# EAGLE design BPtoJTAG_ICSP - Rev A1 (EAGLE 7.7.0)
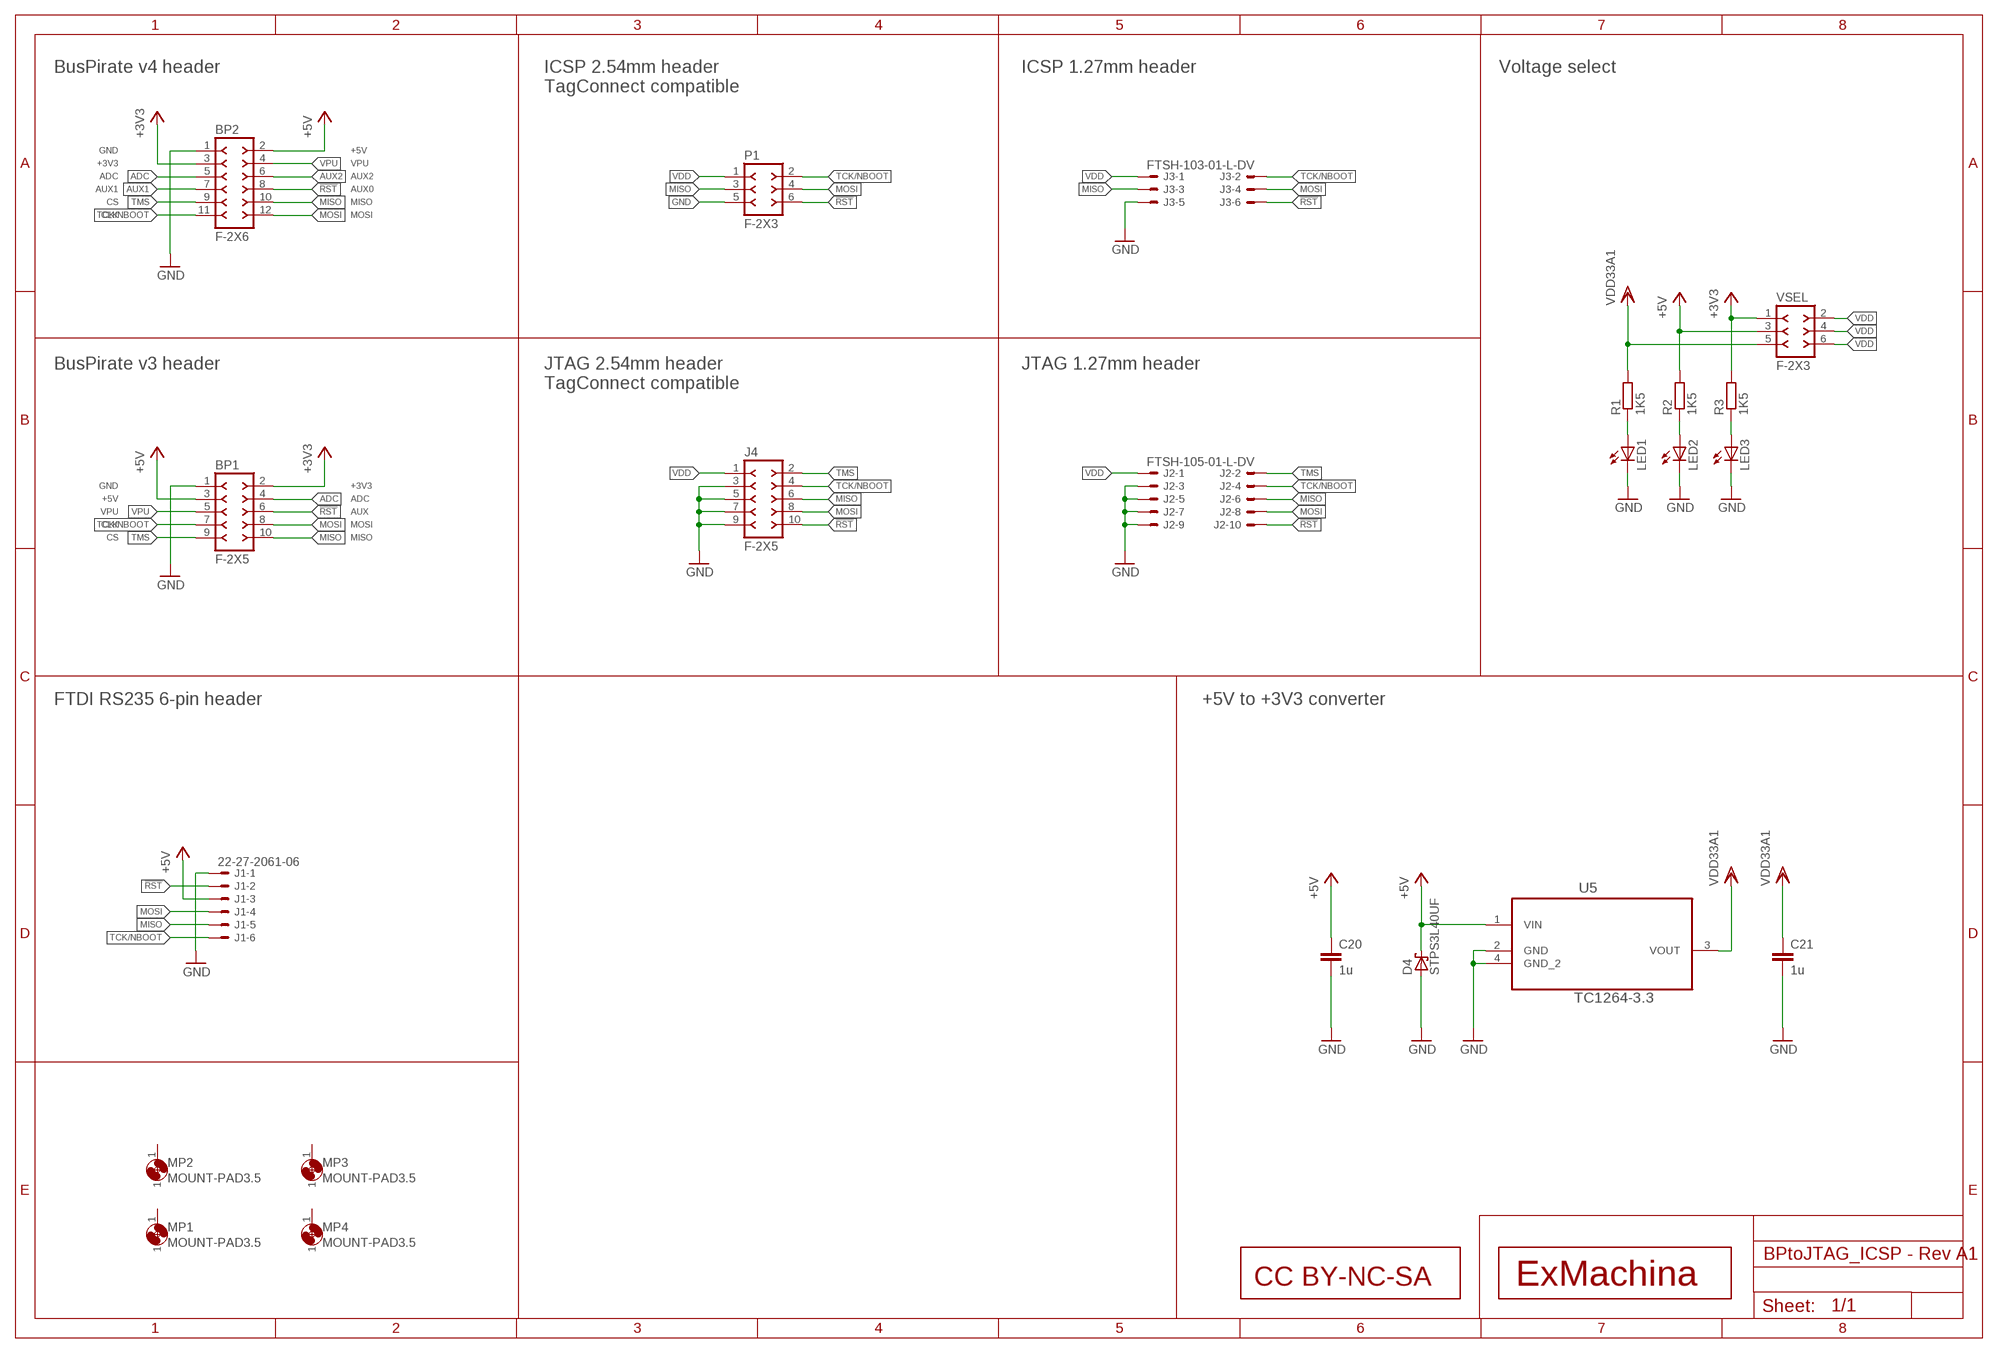
[diagram p0: schematic, sheet 1]

## Parts
BP1  F-2X5  [DIL-100-2X5]
BP2  F-2X6  [DIL-100-2X6]
C20  1u  C-EUC0603  [C0603]
C21  1u  C-EUC0603  [C0603]
CC1  CC-BY-NC-SA  [CC-BY-NC-SA]
D4  STPS3L40UF  [SMB]
J1  22-27-2061-06  [6410-06]
J2  FTSH-105-01-L-DV  [FTSH-105-01-L-DV]
J3  FTSH-103-01-L-DV  [FTSH-103-01-L-DV]
J4  F-2X5  [DIL-100-2X5]
LED1  LEDCHIPLED_0603  [CHIPLED_0603]
LED2  LEDCHIPLED_0603  [CHIPLED_0603]
LED3  LEDCHIPLED_0603  [CHIPLED_0603]
MP1  MOUNT-PAD3.5  [P3,5]
MP2  MOUNT-PAD3.5  [P3,5]
MP3  MOUNT-PAD3.5  [P3,5]
MP4  MOUNT-PAD3.5  [P3,5]
P1  F-2X3  [DIL-100-2X3]
R1  1K5  R-EU_R0603  [R0603]
R2  1K5  R-EU_R0603  [R0603]
R3  1K5  R-EU_R0603  [R0603]
T1  EXMACHINA-LOGO-NAME  [EXM-LOGO-BASELINE]
U5  TC1264-3.3  [SOT230P700X180-4N]
VSEL  F-2X3  [DIL-100-2X3]

## Nets
!RST: BP1.6 BP2.8 J1.2 J2.10 J3.6 J4.10 P1.6
+3V3 [supply]: BP1.2 BP2.3 R3.2 VSEL.1
+5V [supply]: BP1.3 BP2.2 C20.1 D4.C J1.3 R2.2 U5.1(VIN) VSEL.3
ADC: BP1.4 BP2.5
AUX1: BP2.7
AUX2: BP2.6
GND [supply]: BP1.1 BP2.1 C20.2 C21.2 D4.A J1.1 J2.3 J2.5 J2.7 J2.9 J3.5 J4.3 J4.5 J4.7 J4.9 LED1.C LED2.C LED3.C P1.5 U5.2(GND) U5.4(GND_2)
MISO: BP1.10 BP2.10 J1.5 J2.6 J3.3 J4.6 P1.3
MOSI: BP1.8 BP2.12 J1.4 J2.8 J3.4 J4.8 P1.4
N$1: LED1.A R1.1
N$2: LED2.A R2.1
N$3: LED3.A R3.1
TCK/NBOOT: BP1.7 BP2.11 J1.6 J2.4 J3.2 J4.4 P1.2
TMS: BP1.9 BP2.9 J2.2 J4.2
VDD [supply]: J2.1 J3.1 J4.1 P1.1 VSEL.2 VSEL.4 VSEL.6
VDD33A1 [supply]: C21.1 R1.2 U5.3(VOUT) VSEL.5
VPU: BP1.5 BP2.4
Unconnected: MP1.1 MP2.1 MP3.1 MP4.1

## Notes on the sheet
- BusPirate v4 header
- ICSP 2.54mm header
  TagConnect compatible
- ICSP 1.27mm header | Voltage select
- GND | +5V
- +3V3 | VPU
- ADC | AUX2
- AUX1 | AUX0
- CS | MISO
- CLK | MOSI
- BusPirate v3 header
- JTAG 2.54mm header
  TagConnect compatible
- JTAG 1.27mm header
- GND | +3V3
- +5V | ADC
- VPU | AUX
- CLK | MOSI
- CS | MISO
- FTDI RS235 6-pin header | +5V to +3V3 converter

## Library data of the parts
BP1 J4 = con-headers-jp:F-2X5
BP2 = con-headers-jp:F-2X6
C20 C21 = rcl:C-EU: CAPACITOR, European symbol
CC1 = cc-by-sa:CC-BY-NC-SA
D4 = diode:STPS3L40?; MP: STMICROELECTRONICS; MPN: STPS3L40UF; OC_FARNELL: 2341599; OC_NEWARK: 06X0873
J1 = con-molex:22-?-06: CONNECTOR wire to board 2.54 mm (.1 inch) pitch header; OC_FARNELL: unknown; OC_NEWARK: unknown
J2 = con-samtec:FTSH-105-01-L-DV
J3 = con-samtec:FTSH-103-01-L-DV
LED1-LED3 = led:LED: LED OSRAM: - CHIPLED LG R971, LG N971, LY N971, LG Q971, LY Q971, LO R971, LY R971 LH N974, LH R974 LS Q976, LO Q976, LY Q976 LO Q996 - Hyper CHIPLED LW Q18S LB Q993, LB Q99A, LB R99A - SideLED LS A670, LO A670, LY A670, LG A670, LP A670 LB A673, LV A673, LT A673, LW A673 LH A674 LY A675 LS A676, LA A676, LO A676, LY A676, LW A676 LS A679, LY A679, LG A679 - Hyper Micro SIDELED® LS Y876, LA Y876, LO Y876, LY Y876 LT Y87S - SmartLED LW L88C, LW L88S LB L89C, LB L89S, LG L890 LS L89K, LO L89K, LY L89K LS L896, LA L896, LO L896, LY L896 - TOPLED LS T670, LO T670, LY T670, LG T670, LP T670 LSG T670, LSP T670, LSY T670, LOP T670, LYG T670 LG T671, LOG T671, LSG T671 LB T673, LV T673, LT T673, LW T673 LH T674 LS T676, LA T676, LO T676, LY T676, LB T676, LH T676, LSB T676, LW T676 LB T67C, LV T67C, LT T67C, LS T67K, LO T67K, LY T67K, LW E67C LS E67B, LA E67B, LO E67B, LY E67B, LB E67C, LV E67C, LT E67C LW T67C LS T679, LY T679, LG T679 LS T770, LO T770, LY T770, LG T770, LP T770 LB T773, LV T773, LT T773, LW T773 LH T774 LS E675, LA E675, LY E675, LS T675 LS T776, LA T776, LO T776, LY T776, LB T776 LHGB T686 LT T68C, LB T68C - Hyper Mini TOPLED® LB M676 - Mini TOPLED Santana® LG M470 LS M47K, LO M47K, LY M47K Source: http://www.osram.convergy.de LUXEON: - LUMILED® LXK2-PW12-R00, LXK2-PW12-S00, LXK2-PW14-U00, LXK2-PW14-V00 LXK2-PM12-R00, LXK2-PM12-S00, LXK2-PM14-U00 LXK2-PE12-Q00, LXK2-PE12-R00, LXK2-PE12-S00, LXK2-PE14-T00, LXK2-PE14-U00 LXK2-PB12-K00, LXK2-PB12-L00, LXK2-PB12-M00, LXK2-PB14-N00, LXK2-PB14-P00, LXK2-PB14-Q00 LXK2-PR12-L00, LXK2-PR12-M00, LXK2-PR14-Q00, LXK2-PR14-R00 LXK2-PD12-Q00, LXK2-PD12-R00, LXK2-PD12-S00 LXK2-PH12-R00, LXK2-PH12-S00 LXK2-PL12-P00, LXK2-PL12-Q00, LXK2-PL12-R00 Source: www.luxeon.com KINGBRIGHT: KA-3528ASYC Source: www.kingbright.com
MP1-MP4 = holes:MOUNT-PAD: MOUNTING HOLE with drill center marker
P1 VSEL = con-headers-jp:F-2X3
R1-R3 = rcl:R-EU_: RESISTOR, European symbol
T1 = exmachina:EXMACHINA-LOGO
U5 = microchip-6:TC1264-3.3: IC, 8 00mA Fixed Output CMOS LDO,3.3V,SOT-223, 3-lead; PACKAGE: SOT-223-3; SUPPLIER: Microchip

## Net classes
0 default: width 0.203 mm
2 supply: width 0.406 mm, drill 0.5 mm

## Board
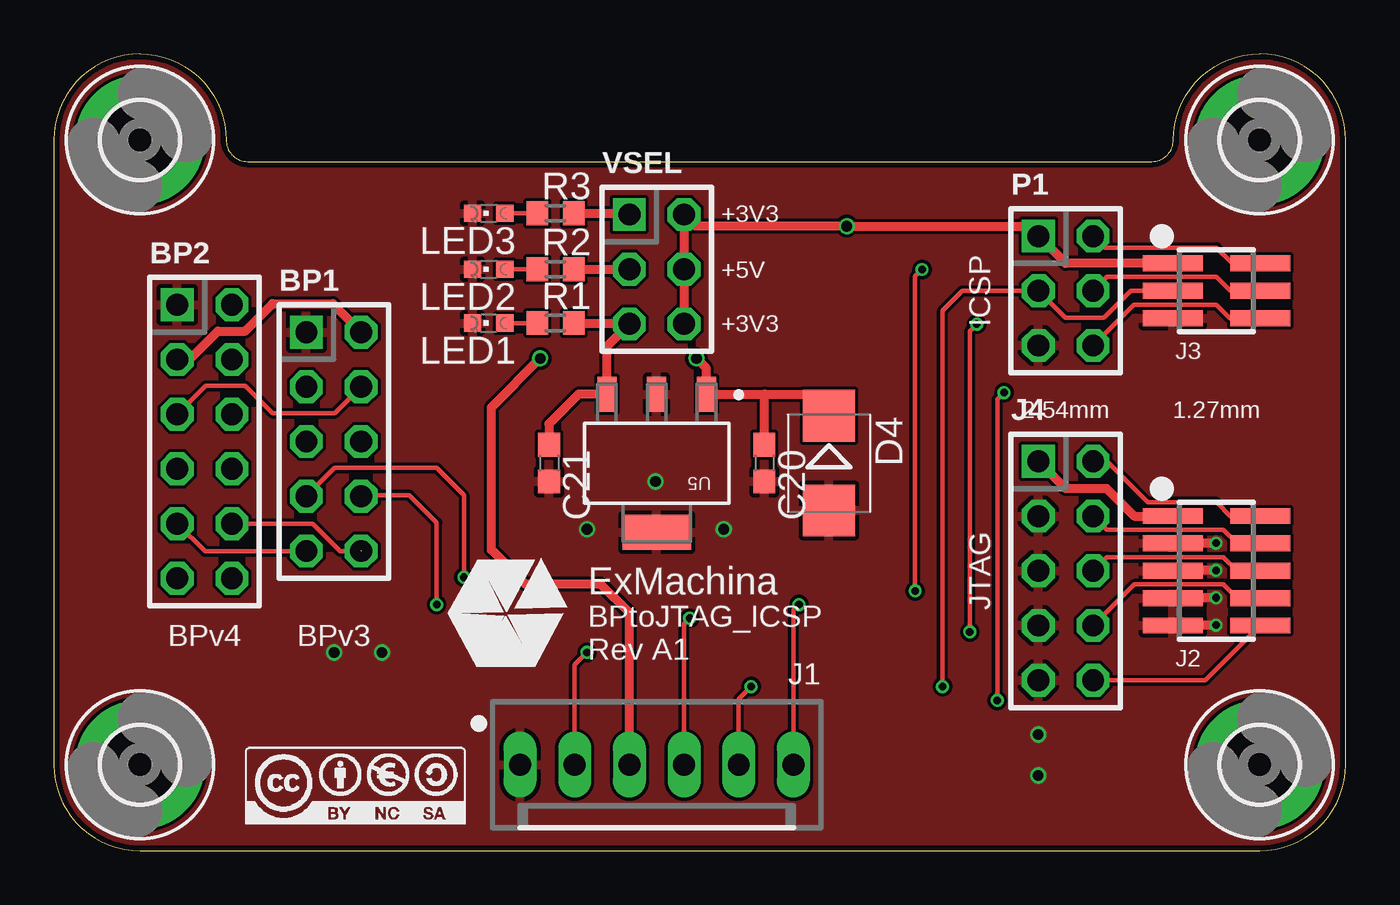
[diagram p1: board, top side]
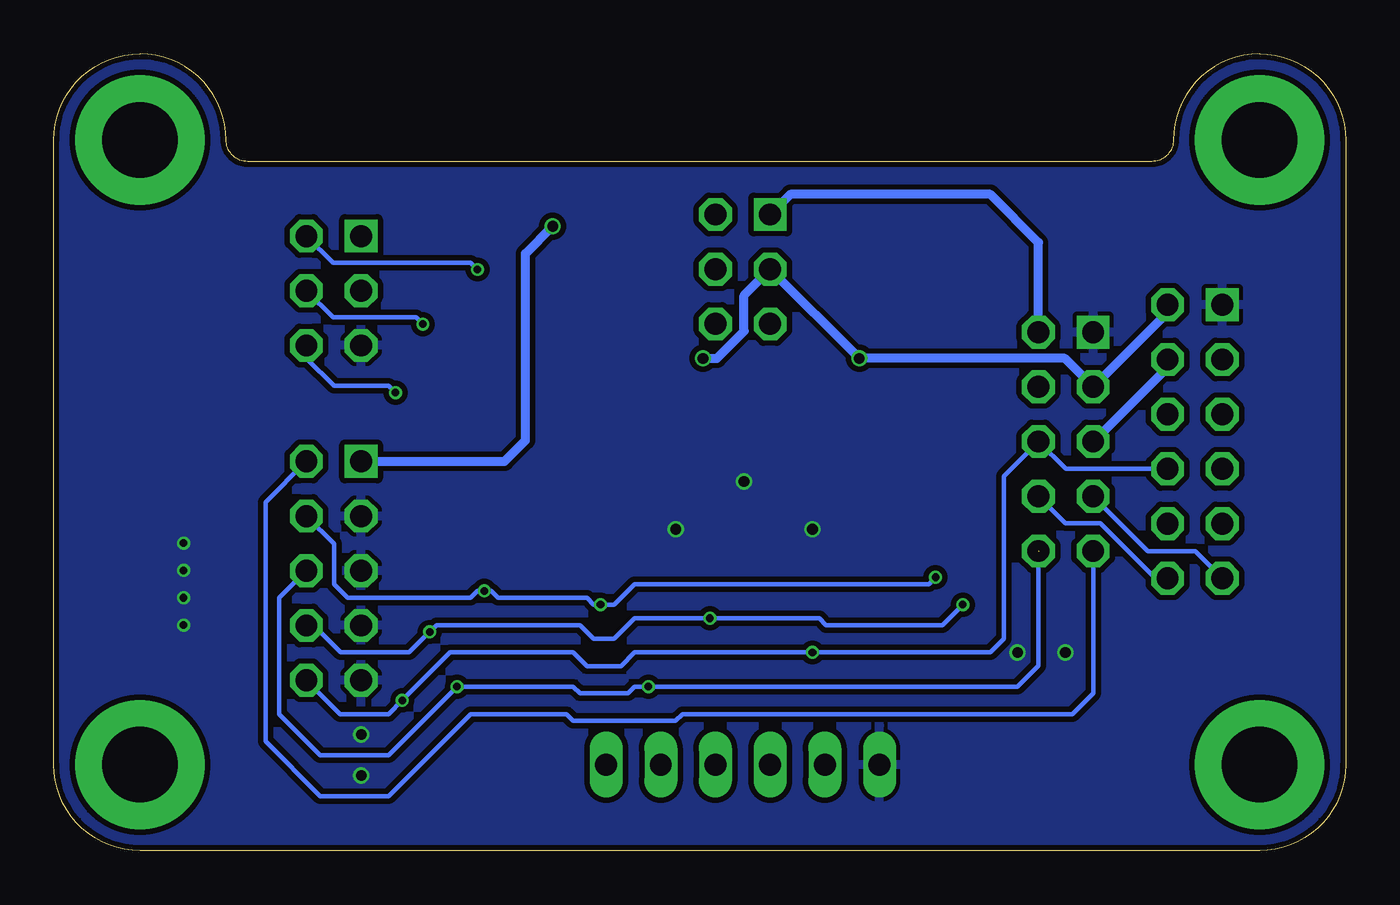
[diagram p2: board, bottom side, seen from below]

Size 60 x 37 mm. Coordinates in mm from the lower left corner, seen from the top.
Outline: 60,4 60,33 arc90 56,37 arc90 52,33 arc-90 51,32 9,32 arc-90 8,33 arc90 4,37 arc90 0,33 0,4 arc90 4,0 56,0 arc90 60,4
Copper layers (1*16): Top 0.018mm / dielectric 1.55mm / Bottom 0.018mm
Design rules "eC_2Layer_PClass6_BaseCopperO18_eCDefault *": minimum track width 0.15mm, minimum drill 0.35mm, track to track 0.15mm, track to pad 0.15mm, pad to pad 0.15mm, via to via 0.15mm, smd to smd 0mil, copper to edge 0.25mm, drill to drill 0.35mm, minimum pad ring 0.175mm, minimum via ring 0.125mm, stop-mask expansion 0mil, vias tented up to drill 0.45mm, thermal gap 0.2mm

### Footprints (pad centres in the part's own frame; a part is rotated, then mirrored left to right if it is on the bottom)
DIL-100-2X5 = drill 1.016 square: 1 -5.08,-1.27 | drill 1.016 octagon: 2 -5.08,1.27; 3 -2.54,-1.27; 4 -2.54,1.27; 5 0,-1.27; 6 0,1.27; 7 2.54,-1.27; 8 2.54,1.27; 9 5.08,-1.27; 10 5.08,1.27
DIL-100-2X6 = drill 1.016 square: 1 -6.35,-1.27 | drill 1.016 octagon: 2 -6.35,1.27; 3 -3.81,-1.27; 4 -3.81,1.27; 5 -1.27,-1.27; 6 -1.27,1.27; 7 1.27,-1.27; 8 1.27,1.27; 9 3.81,-1.27; 10 3.81,1.27; 11 6.35,-1.27; 12 6.35,1.27
C0603 = smd 1.1 x 1: 1 -0.85,0; 2 0.85,0
SMB = smd 2.4 x 2.4: A 2.2,0; C -2.2,0
6410-06 = drill 1.016 long: 1 6.35,0; 2 3.81,0; 3 1.27,0; 4 -1.27,0; 5 -3.81,0; 6 -6.35,0
FTSH-105-01-L-DV = smd 0.737 x 2.794: 1 -2.54,-2.032; 2 -2.54,2.032; 3 -1.27,-2.032; 4 -1.27,2.032; 5 0,-2.032; 6 0,2.032; 7 1.27,-2.032; 8 1.27,2.032; 9 2.54,-2.032; 10 2.54,2.032
FTSH-103-01-L-DV = smd 0.737 x 2.794: 1 -1.27,-2.032; 2 -1.27,2.032; 3 0,-2.032; 4 0,2.032; 5 1.27,-2.032; 6 1.27,2.032
CHIPLED_0603 = smd 0.8 x 0.8: A 0,-0.75; C 0,0.75
P3,5 = drill 3.5 pad 6: 1 0,0
DIL-100-2X3 = drill 1.016 square: 1 -2.54,-1.27 | drill 1.016 octagon: 2 -2.54,1.27; 3 0,-1.27; 4 0,1.27; 5 2.54,-1.27; 6 2.54,1.27
R0603 = smd 1 x 1.1: 1 -0.85,0; 2 0.85,0
SOT230P700X180-4N = smd 1.626 x 0.889: 1 -3.2,2.311; 2 -3.2,0; 3 -3.2,-2.311 | smd 1.626 x 3.175: 4 3.2,0

### Placement (x,y rotation side)
BP1  13,19 270 top
BP2  7,19 270 top
C20  33,18 270 top
C21  23,18 270 top
CC1  14,3 0 top
D4  36,18 270 top
J1  28,4 180 top
J2  54,13 270 top
J3  54,26 270 top
J4  47,13 270 top
LED1  20.2,24.5 90 top
LED2  20.2,27 90 top
LED3  20.2,29.6 90 top
MP1  4,4 0 top
MP2  4,33 0 top
MP3  56,4 0 top
MP4  56,33 0 top
P1  47,26 270 top
R1  23.3,24.5 0 top
R2  23.3,27 0 top
R3  23.3,29.6 0 top
T1  21,11 0 top
U5  28,18 270 top
VSEL  28,27 270 top

### Tracks (layer width: path | path; a pad name or v marks a point on that pad's centre or on a via)
!RST  (via drill 0.35)
  Top 0.203: J4.10 53.49,7.92 J2.10 | J3.6 54.62,24.73 54,25.35 50.16,25.35 P1.6 | J1.2 24.19,8.63 v24.77,9.21 | v43.81,6.99 43.81,20.95 v44.13,21.27
  Bottom 0.203: J4.10 46.7,6.35 44.45,6.35 v43.81,6.99 41.59,9.21 35.88,9.21 35.24,8.57 33.66,8.57 33.02,9.21 v24.77,9.21 16.51,9.21 15.88,9.84 15.88,17.39 BP1.6 13,17.73 BP2.8 | v44.13,21.27 44.45,21.59 46.99,21.59 48.27,22.87 P1.6
+3V3
  Top 0.406: R3.2 26.67,29.6 VSEL.1 | BP2.3 6.3,22.81 7.62,24.13 8.89,24.13 10.16,25.4 12.95,25.4 BP1.2
  Bottom 0.406: BP1.2 14.27,28.24 16.51,30.48 25.79,30.48 VSEL.1
+5V  (via drill 0.5)
  Top 0.406: R2.2 VSEL.3 | v29.84,22.86 30.31,22.39 U5.1 33.02,21.2 | 33.02,21.2 35,21.2 D4.C | C20.1 33,21.18 33.02,21.2 | J1.3 26.73,11.05 25.4,12.38 21.91,12.38 20.32,13.97 20.32,20.59 v22.59,22.86
  Bottom 0.406: v29.84,22.86 29.21,22.86 27.94,24.13 27.94,25.79 VSEL.3 v22.59,22.86 13.05,22.86 BP1.3 8.27,25 BP2.2
ADC
  Top 0.203: BP2.5 7.05,21.59 8.89,21.59 10.16,20.32 13.05,20.32 BP1.4
GND  (via drill 0.35, 0.5)
  Top 0.406: v53.98,10.48 51.75,10.48 | v53.98,11.75 51.75,11.75 | v53.98,13.02 51.75,13.02 | v53.98,14.29 51.75,14.29
  other vias: 31.11,14.92 13.02,9.21 15.24,9.21 45.72,5.4 45.72,3.49 24.77,14.92 27.94,17.14
  pour Bottom (isolate 0.254): -4,-4 -4,41 64,41 64,-4
  pour Top: -2,-2 -2,39 62,39 62,-2
MISO  (via drill 0.35)  (1 unrouted)
  Top 0.203: BP2.10 12.01,15.19 13.3,13.9 14.25,13.9 | J4.6 48.91,13.64 54.32,13.64 54.96,13 J2.6 | J3.3 50.03,26 48.77,24.74 46.99,24.74 P1.3 42.19,26 41.27,25.08 v41.27,7.62 | J1.5 31.81,7.04 v32.38,7.62
  Bottom 0.203: BP1.10 14.27,8.59 15.24,7.62 v32.38,7.62 33.02,7.62 33.34,7.3 35.56,7.3 35.88,7.62 v41.27,7.62 44.45,4.45 47.62,4.45 49.53,6.35 49.53,11.74 J4.6
MOSI  (via drill 0.35)
  Top 0.203: J4.8 50.18,12.37 54.32,12.37 54.96,11.73 J2.8 | J3.4 54.65,26 54,26.64 48.91,26.64 P1.4 | v17.78,11.43 17.78,15.24 16.51,16.51 14.32,16.51 BP1.8 | J1.4 29.27,10.54 v29.53,10.79 | v42.55,10.16 42.55,24.13 v42.86,24.45
  Bottom 0.203: BP2.12 8.85,12.65 11.4,15.2 13.01,15.2 BP1.8 | v17.78,11.43 18.73,10.48 24.13,10.48 24.45,10.79 v29.53,10.79 33.02,10.79 33.97,9.84 34.92,9.84 35.56,10.48 42.23,10.48 v42.55,10.16 43.5,9.21 46.67,9.21 47.92,10.46 J4.8 | v42.86,24.45 43.18,24.77 47.03,24.77 P1.4
N$1
  Top 0.203: R1.1 LED1.A
N$2
  Top 0.203: R2.1 LED2.A
N$3
  Top 0.203: R3.1 LED3.A
TCK/NBOOT  (via drill 0.35)
  Top 0.203: J4.4 48.9,14.91 54.32,14.91 54.96,14.27 J2.4 | P1.2 48.81,28 54,28 54.73,27.27 J3.2 | BP1.7 13.05,17.78 17.78,17.78 19.05,16.51 v19.05,12.7 | J1.6 34.35,11.17 v34.61,11.43 | v40.01,12.06 40.01,26.67 v40.32,26.99
  Bottom 0.203: BP2.11 6.98,13.9 9.2,13.9 11.73,16.43 BP1.7 | v19.05,12.7 19.37,12.38 33.02,12.38 33.97,11.43 v34.61,11.43 34.92,11.43 35.24,11.75 39.37,11.75 39.69,12.06 v40.01,12.06 40.32,12.06 40.64,11.75 46.35,11.75 46.99,12.38 46.99,14.26 J4.4 | v40.32,26.99 40.64,27.3 47.03,27.3 P1.2
TMS
  Top 0.203: BP2.9 7.02,13.9 11.71,13.9 BP1.9 | J2.2 54.64,15.54 54,16.18 50.81,16.18 48.91,18.08 J4.2
  Bottom 0.203: BP1.9 11.73,7.32 12.7,6.35 30.8,6.35 31.11,6.03 35.88,6.03 36.2,6.35 40.64,6.35 44.45,2.54 47.62,2.54 50.16,5.08 50.16,16.18 J4.2
VDD  (via drill 0.5)
  Top 0.406: J3.1 47,27.27 P1.1 45.27,29 v36.83,29 29.81,29 VSEL.2 VSEL.4 VSEL.6 | J4.1 46.98,16.83 48.9,16.83 50.18,15.54 J2.1
  Bottom 0.406: J4.1 39.07,18.08 38.1,19.05 38.1,27.73 v36.83,29
VDD33A1
  Top 0.406: R1.2 26.69,24.5 VSEL.5 25.69,23.42 U5.3 24.38,21.2 23,19.82 C21.1
VPU
  Bottom 0.406: BP1.5 8.27,22.46 BP2.4

### Text on the board
tPlace: +3V3 | +5V | ICSP | +3V3 | 2.54mm | 1.27mm | JTAG | BPtoJTAG_ICSP / Rev A1 | BPv4 | BPv3